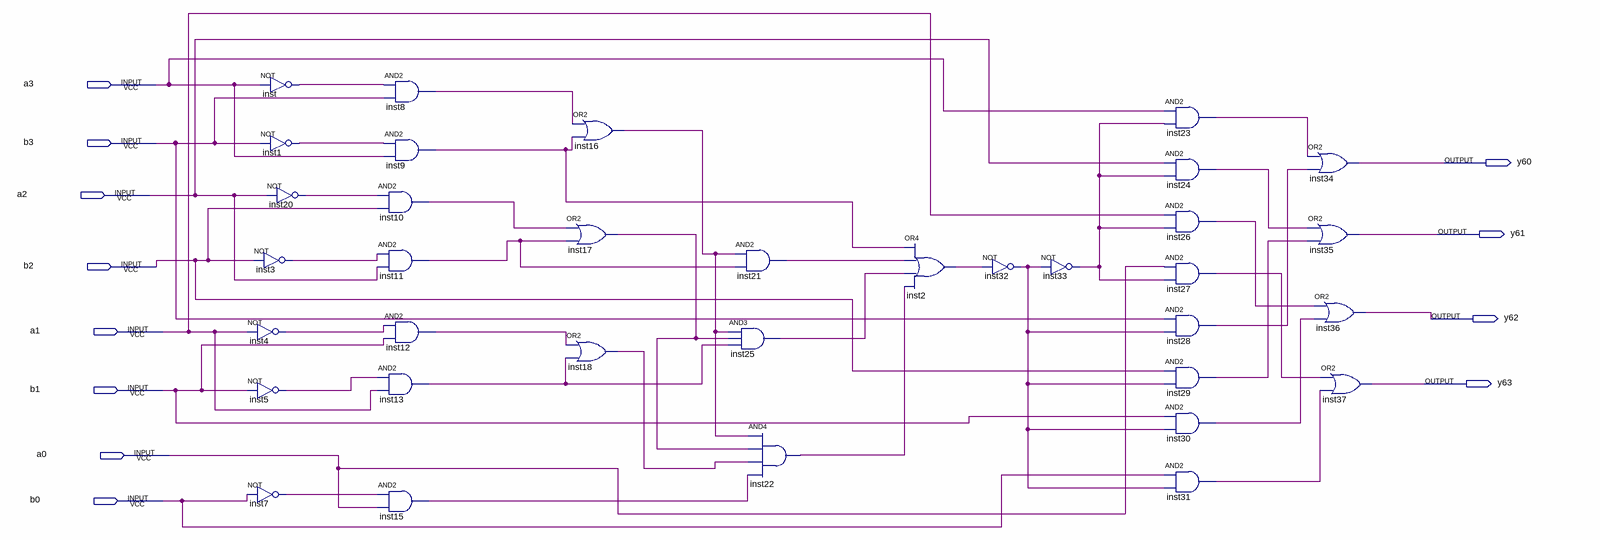
[diagram p0: schematic sheet]
// Quartus schematic com.bdf as structural Verilog: 35 symbols, 12 pins
module com (
  input  a3,
  input  b3,
  input  a2,
  input  b2,
  input  a1,
  input  b1,
  input  a0,
  input  b0,
  output y60,
  output y61,
  output y62,
  output y63
);

  wire inst1_out, inst2_out, inst3_out, inst4_out, inst5_out, inst7_out, inst8_out, inst9_out, inst10_out,
       inst11_out, inst12_out, inst13_out, inst15_out, inst16_out, inst17_out, inst18_out, inst20_out,
       inst21_out, inst22_out, inst23_out, inst24_out, inst25_out, inst26_out, inst27_out, inst28_out,
       inst29_out, inst30_out, inst31_out, inst32_out, inst33_out, inst_out;

  not inst (inst_out, a3);
  not inst1 (inst1_out, b3);
  not inst20 (inst20_out, a2);
  not inst3 (inst3_out, b2);
  not inst4 (inst4_out, a1);
  not inst5 (inst5_out, b1);
  not inst7 (inst7_out, b0);
  and inst10 (inst10_out, inst20_out, b2);
  and inst11 (inst11_out, inst3_out, a2);
  and inst13 (inst13_out, inst5_out, a1);
  and inst15 (inst15_out, inst7_out, a0);
  and inst8 (inst8_out, inst_out, b3);
  and inst9 (inst9_out, inst1_out, a3);
  and inst12 (inst12_out, inst4_out, b1);
  or inst16 (inst16_out, inst8_out, inst9_out);
  or inst17 (inst17_out, inst10_out, inst11_out);
  or inst18 (inst18_out, inst12_out, inst13_out);
  and inst21 (inst21_out, inst16_out, inst11_out);
  and inst25 (inst25_out, inst16_out, inst17_out, inst13_out);
  and inst22 (inst22_out, inst16_out, inst17_out, inst18_out, inst15_out);
  or inst2 (inst2_out, inst9_out, inst21_out, inst25_out, inst22_out);
  not inst32 (inst32_out, inst2_out);
  not inst33 (inst33_out, inst32_out);
  and inst23 (inst23_out, a3, inst33_out);
  and inst24 (inst24_out, a2, inst33_out);
  and inst26 (inst26_out, a1, inst33_out);
  and inst27 (inst27_out, a0, inst33_out);
  and inst28 (inst28_out, b3, inst32_out);
  and inst29 (inst29_out, b2, inst32_out);
  and inst30 (inst30_out, b1, inst32_out);
  and inst31 (inst31_out, b0, inst32_out);
  or inst34 (y60, inst23_out, inst28_out);
  or inst35 (y61, inst24_out, inst29_out);
  or inst36 (y62, inst26_out, inst30_out);
  or inst37 (y63, inst27_out, inst31_out);
endmodule
